# EAGLE design notchfilter (EAGLE 5.12)
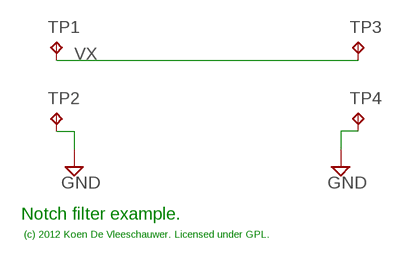
[diagram p0: schematic, sheet 1]

## Parts
TP1  TPTP10SQ  [TP10SQ]
TP2  TPTP10SQ  [TP10SQ]
TP3  TPTP10SQ  [TP10SQ]
TP4  TPTP10SQ  [TP10SQ]

## Nets
GND: TP2.TP TP4.TP
VX: TP1.TP TP3.TP

## Notes on the sheet
- Notch filter example.
- (c) 2012 Koen De Vleeschauwer. Licensed under GPL.

## Library data of the parts
TP1-TP4 = testpad:TP: Test pad

## Board
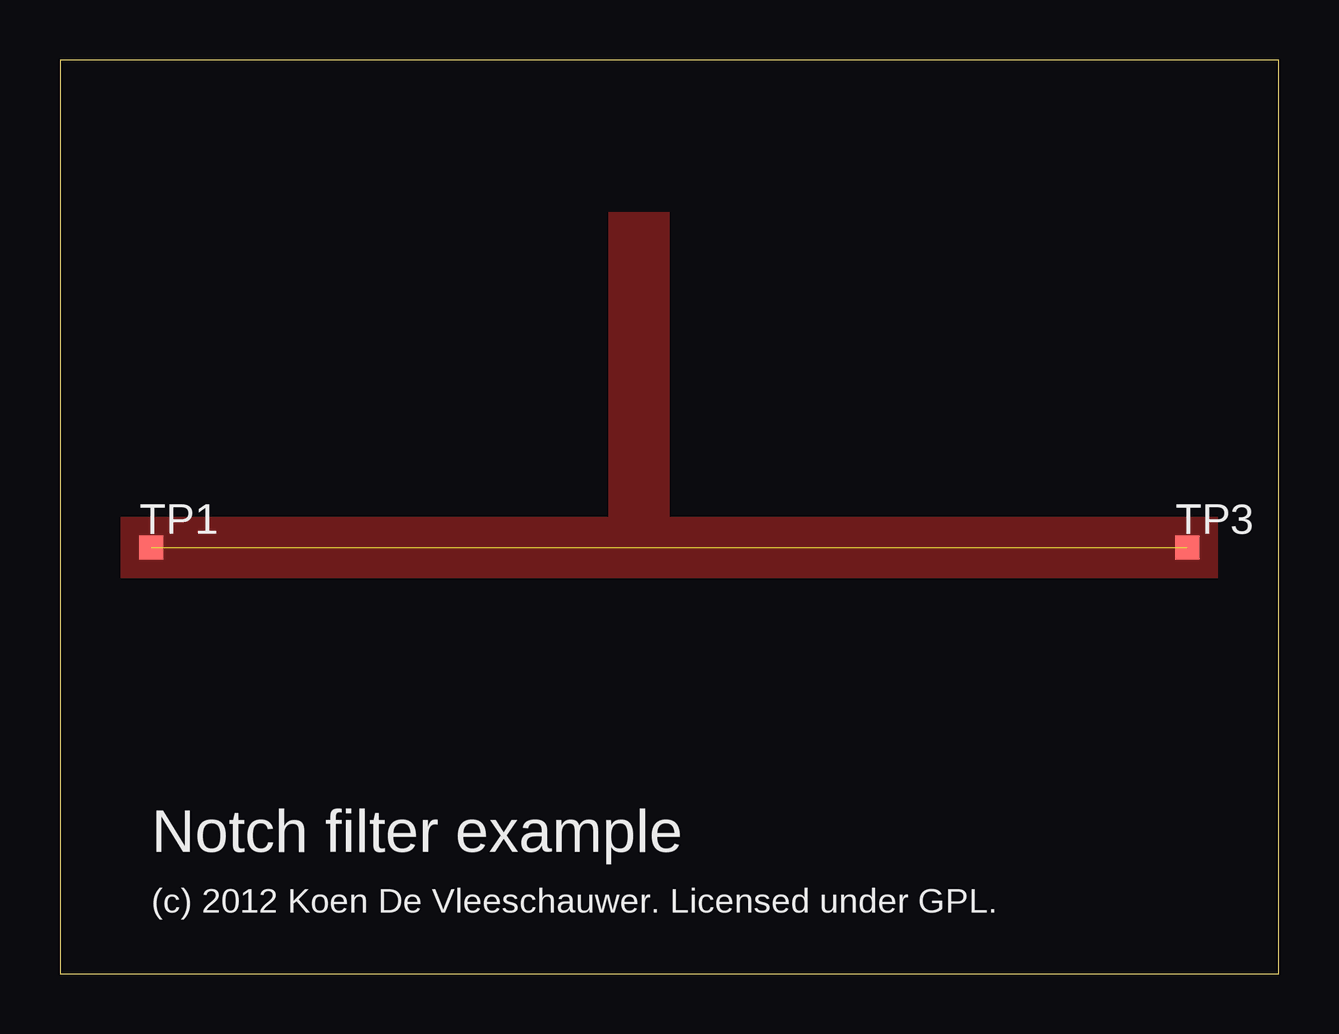
[diagram p1: board, top side]
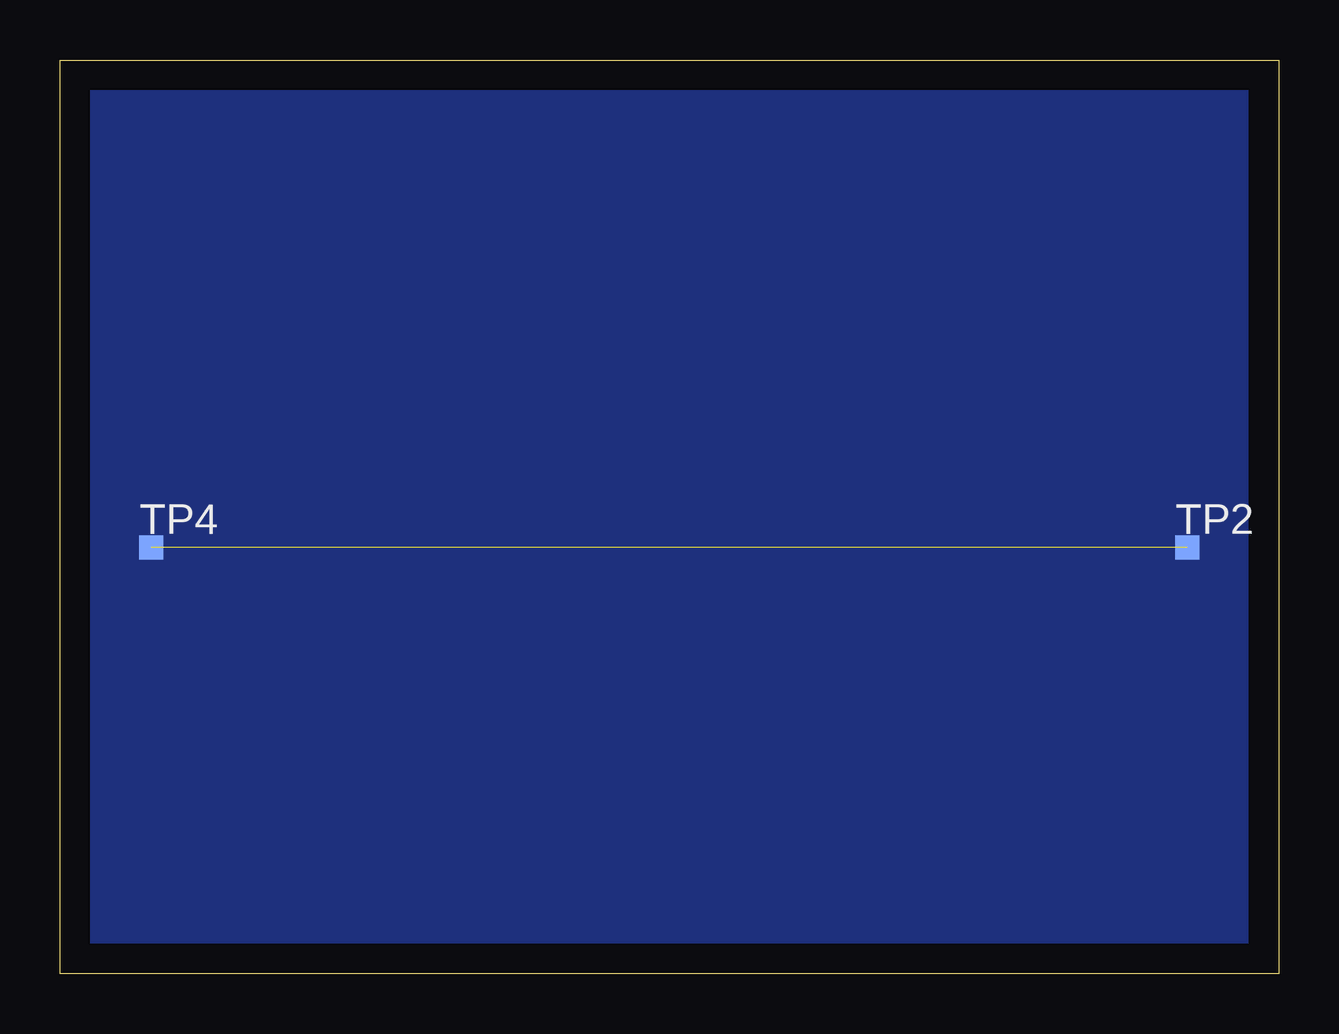
[diagram p2: board, bottom side, seen from below]

Size 50.8 x 38.1 mm. Coordinates in mm from the lower left corner, seen from the top.
Outline: 0,0 50.8,0 50.8,38.1 0,38.1 0,0
Copper layers (1*16): Top 0.035mm / dielectric 1.5mm / Bottom 0.035mm
Design rules "default": minimum track width 10mil, minimum drill 24mil, track to track 8mil, track to pad 8mil, pad to pad 8mil, via to via 8mil, smd to smd 8mil, copper to edge 40mil, drill to drill 8mil, minimum pad ring 10mil, minimum via ring 8mil, stop-mask expansion 4mil, vias tented up to drill 0mil, thermal gap 10mil

### Footprints (pad centres in the part's own frame; a part is rotated, then mirrored left to right if it is on the bottom)
TP10SQ = smd 1 x 1: TP 0,0

### Placement (x,y rotation side)
TP1  3.81,17.78 0 top
TP2  3.81,17.78 0 bottom
TP3  46.99,17.78 0 top
TP4  46.99,17.78 0 bottom

### Tracks (layer width: path | path; a pad name or v marks a point on that pad's centre or on a via)
GND  (1 unrouted)
  pour Bottom (no thermals): 1.27,36.83 49.53,36.83 49.53,1.27 1.27,1.27
VX  (1 unrouted)
  pour Top (no thermals): 2.54,19.05 22.86,19.05 22.86,31.75 25.4,31.75 25.4,19.05 48.26,19.05 48.26,16.51 2.54,16.51

### Text on the board
tPlace: Notch filter example | (c) 2012 Koen De Vleeschauwer. Licensed under GPL.